# Altium schematic sheet USB-UART_1.0.SchDoc
size A
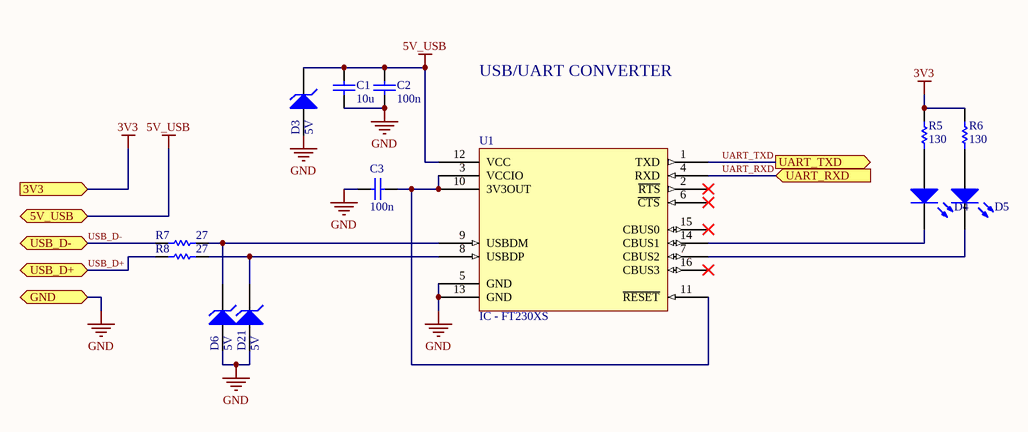
[diagram p0: USB-UART_1.0.SchDoc]

## Parts
C1  value 10u  [CS-0603]  (hidden comment: CS - CAPACITOR)
C2  value 100n  [CS-0603]  (hidden comment: CS - CAPACITOR)
C3  value 100n  [CS-0603]  (hidden comment: CS - CAPACITOR)
D3  Voltage - Reverse Standoff (Typ): 5V  [DS-SOD523]  (hidden comment: DS - TVS ESD5Z5.0T1G)
D4  LED - NORMAL LED  [LED-0603 BLUE]  (value not drawn)
D5  LED - NORMAL LED  [LED-0603 BLUE]  (value not drawn)
D6  Voltage - Reverse Standoff (Typ): 5V  [DS-SOD523]  (hidden comment: DS - TVS ESD5Z5.0T1G)
D21  Voltage - Reverse Standoff (Typ): 5V  [DS-SOD523]  (hidden comment: DS - TVS ESD5Z5.0T1G)
R5  value 130  [RS-0603]  (hidden comment: RS - RESISTOR)
R6  value 130  [RS-0603]  (hidden comment: RS - RESISTOR)
R7  value 27  [RS-0603]  (hidden comment: RS - RESISTOR)
R8  value 27  [RS-0603]  (hidden comment: RS - RESISTOR)
U1  IC - FT230XS  [IC-SSOP-16]

## Ports
3V3 (in), 5V_USB, GND, UART_RXD (in), UART_TXD (out), USB_D+ (bidir), USB_D- (bidir)

## Nets
3V3: R5.2 R6.2 ; port 3V3
5V_USB: C1.2 C2.2 D3.K U1.12(VCC) ; port 5V_USB
GND: C1.1 C2.1 C3.2 D3.A D6.A D21.A U1.5(GND) U1.13(GND) ; port GND
UART_RXD: U1.4(RXD) ; port UART_RXD
UART_TXD: U1.1(TXD) ; port UART_TXD
USB_D+: R8.2 ; port USB_D+
USB_D-: R7.2 ; port USB_D-
NetC3_1: C3.1 U1.3(VCCIO) U1.10(3V3OUT) U1.11(~{RESET})
NetD4_A: D4.A R5.1
NetD4_K: D4.K U1.14(CBUS1)
NetD5_A: D5.A R6.1
NetD5_K: D5.K U1.7(CBUS2)
NetD6_K: D6.K R7.1 U1.9(USBDM)
NetD21_K: D21.K R8.1 U1.8(USBDP)

Not connected (* = marked no-connect by the designer): U1 2(~{RTS})* 6(~{CTS})* 15(CBUS0)* 16(CBUS3)*

## Notes on the sheet
- USB/UART CONVERTER

## Library data of the parts
C1-C3 = CS - CAPACITOR: TOLERANCE: 10%; VOLTAGE: 16V; Supplier 1: *; (FIELD A): *; (FLIED C): *; (FIELD B): *; Manufacturer: *
  C1: Supplier Part Number 1: 587-3238-1-ND
  C2 C3: Supplier Part Number 1: 490-1532-1-ND
D3 D6 D21 = DS - TVS ESD5Z5.0T1G: TVS 5V; Manufacturer: ON Semiconductor; Supplier Part Number 1: ESD5Z5.0T1GOSCT-ND; Supplier 1: *; FORWARS VOLTAGE: *; (FIELD A): *; (FIELD B): *; Supplier 2: Digi-Key; Supplier Part Number 2: ESD5Z5.0T1GOSCT-ND
R5-R8 = RS - RESISTOR: TOLERANCE: RES TOL; POWER: RES POWER; Supplier 1: *; (FIELD A): *; (FLIED C): *; (FIELD B): *; Manufacturer: *
  R5 R6 R8: Supplier Part Number 1: *
  R7: Supplier Part Number 1: RHM27CGCT-ND
U1 = IC - FT230XS: USB to BASIC UART IC; Manufacturer: FTDI; Supplier 1: Digi-Key; Supplier Part Number 1: 768-1154-5-ND; (FIELD A): *; (FIELD B): *; (FIELD C): *
D4 D5 = LED - NORMAL LED: CURRENT: *; COLOR: *; FORWARS VOLTAGE: *; Supplier Part Number 1: *; Supplier 1: *; (FIELD B): *; (FIELD A): *; (FIELD C): *; Manufacturer: *